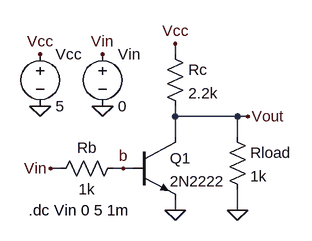
[diagram p0: schematic PL1.asc]
PL1.asc, the LTspice schematic file:
Version 4
SHEET 1 880 680
WIRE 240 32 240 16
WIRE 240 128 240 112
WIRE 336 128 240 128
WIRE 352 128 336 128
WIRE 240 160 240 128
WIRE 336 160 336 128
WIRE 64 208 48 208
WIRE 160 208 144 208
WIRE 176 208 160 208
WIRE 240 272 240 256
WIRE 336 272 336 240
FLAG 240 272 0
FLAG 336 272 0
FLAG 48 208 Vin
FLAG 240 16 Vcc
FLAG 352 128 Vout
FLAG 32 32 Vcc
FLAG 128 32 Vin
FLAG 128 112 0
FLAG 32 112 0
FLAG 160 208 b
SYMBOL res 320 144 R0
SYMATTR InstName Rload
SYMATTR Value 1k
SYMBOL res 160 192 R90
WINDOW 0 0 56 VBottom 2
WINDOW 3 32 56 VTop 2
SYMATTR InstName Rb
SYMATTR Value 1k
SYMBOL res 224 16 R0
SYMATTR InstName Rc
SYMATTR Value 2.2k
SYMBOL npn 176 160 R0
SYMATTR InstName Q1
SYMATTR Value 2N2222
SYMBOL voltage 128 16 R0
WINDOW 123 0 0 Left 0
WINDOW 39 0 0 Left 0
SYMATTR InstName Vin
SYMATTR Value 0
SYMBOL voltage 32 16 R0
WINDOW 123 0 0 Left 0
WINDOW 39 0 0 Left 0
SYMATTR InstName Vcc
SYMATTR Value 5
TEXT 14 272 Left 2 !.dc Vin 0 5 1m

The netlist it stands for:
* PL1.asc
Rload Vout 0 1k
Rb b Vin 1k
Rc Vcc Vout 2.2k
Q1 Vout b 0 0 2N2222
Vin Vin 0 0
Vcc Vcc 0 5
.model NPN NPN
.model PNP PNP
.lib standard.bjt
.dc Vin 0 5 1m
.backanno
.end

* Results of the author's LTspice run, read from the files saved beside the schematic
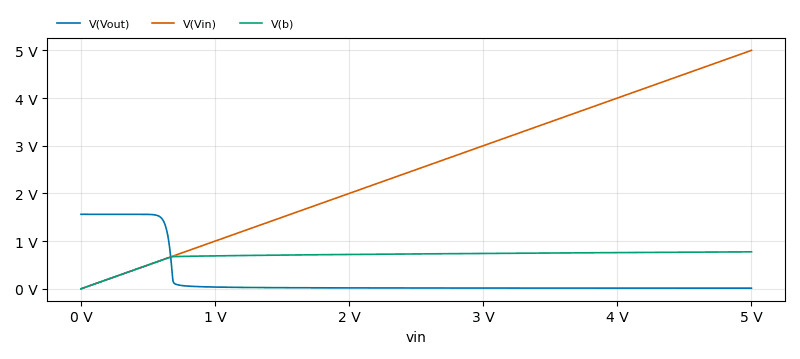
[diagram p1: DC transfer characteristic of PL1.asc, plotted from the saved traces]
* DC transfer characteristic, 1 run:
*   V(Vout): 1.562 V at vin=0 V, 13.31 mV at vin=5 V, min 13.31 mV, max 1.562 V
*   V(Vin): 0 V at vin=0 V, 5 V at vin=5 V, min 0 V, max 5 V
*   V(b): 1.566 nV at vin=0 V, 775.1 mV at vin=5 V, min 1.566 nV, max 775.1 mV